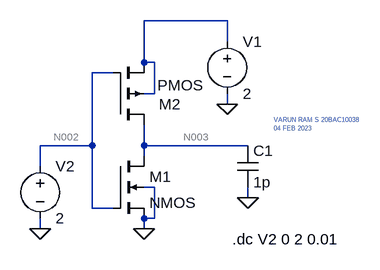
[diagram p0: schematic EXP3.asc]
EXP3.asc, the LTspice schematic file:
Version 4
SHEET 1 880 680
WIRE 336 -32 208 -32
WIRE 336 0 336 -32
WIRE 208 32 208 -32
WIRE 224 32 208 32
WIRE 160 48 128 48
WIRE 224 80 224 32
WIRE 224 80 208 80
WIRE 336 96 336 80
WIRE 128 160 128 48
WIRE 128 160 48 160
WIRE 208 160 208 128
WIRE 368 160 208 160
WIRE 208 176 208 160
WIRE 48 192 48 160
WIRE 224 224 208 224
WIRE 368 240 368 224
WIRE 128 256 128 160
WIRE 160 256 128 256
WIRE 224 272 224 224
WIRE 224 272 208 272
WIRE 48 288 48 272
WIRE 208 288 208 272
FLAG 48 288 0
FLAG 208 288 0
FLAG 336 96 0
FLAG 368 240 0
SYMBOL nmos4 160 176 R0
SYMATTR InstName M1
SYMATTR Value2 l=180n w=2u
SYMBOL pmos4 160 128 M180
WINDOW 0 71 32 Left 2
WINDOW 3 69 61 Left 2
SYMATTR InstName M2
SYMATTR Value2 l=180n w=6u
SYMBOL voltage 336 -16 R0
WINDOW 123 0 0 Left 0
WINDOW 39 0 0 Left 0
SYMATTR InstName V1
SYMATTR Value 2
SYMBOL voltage 48 176 R0
WINDOW 123 0 0 Left 0
WINDOW 39 0 0 Left 0
SYMATTR InstName V2
SYMATTR Value 2
SYMBOL cap 352 160 R0
SYMATTR InstName C1
SYMATTR Value 1p
TEXT 344 304 Left 2 !.dc V2 0 2 0.01
TEXT 408 120 Left 0 ;VARUN RAM S 20BAC10038\n04 FEB 2023

The netlist it stands for:
* EXP3.asc
M1 N003 N002 0 0 NMOS l=180n w=2u
M2 N003 N002 N001 N001 PMOS l=180n w=6u
V1 N001 0 2
V2 N002 0 2
C1 N003 0 1p
.model NMOS NMOS
.model PMOS PMOS
.lib standard.mos
.dc V2 0 2 0.01
* VARUN RAM S 20BAC10038
* 04 FEB 2023
.backanno
.end

* Results of the author's LTspice run, read from the files saved beside the schematic
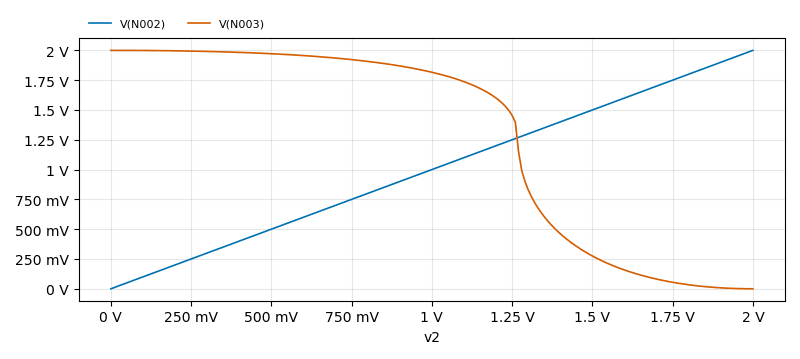
[diagram p1: DC transfer characteristic of EXP3.asc, plotted from the saved traces]
* DC transfer characteristic, 1 run:
*   V(N002): 0 V at v2=0 V, 2 V at v2=2 V, min 0 V, max 2 V
*   V(N003): 2 V at v2=0 V, 3.224 nV at v2=2 V, min 3.224 nV, max 2 V